# EAGLE schematic untitled (EAGLE 8.7.0)
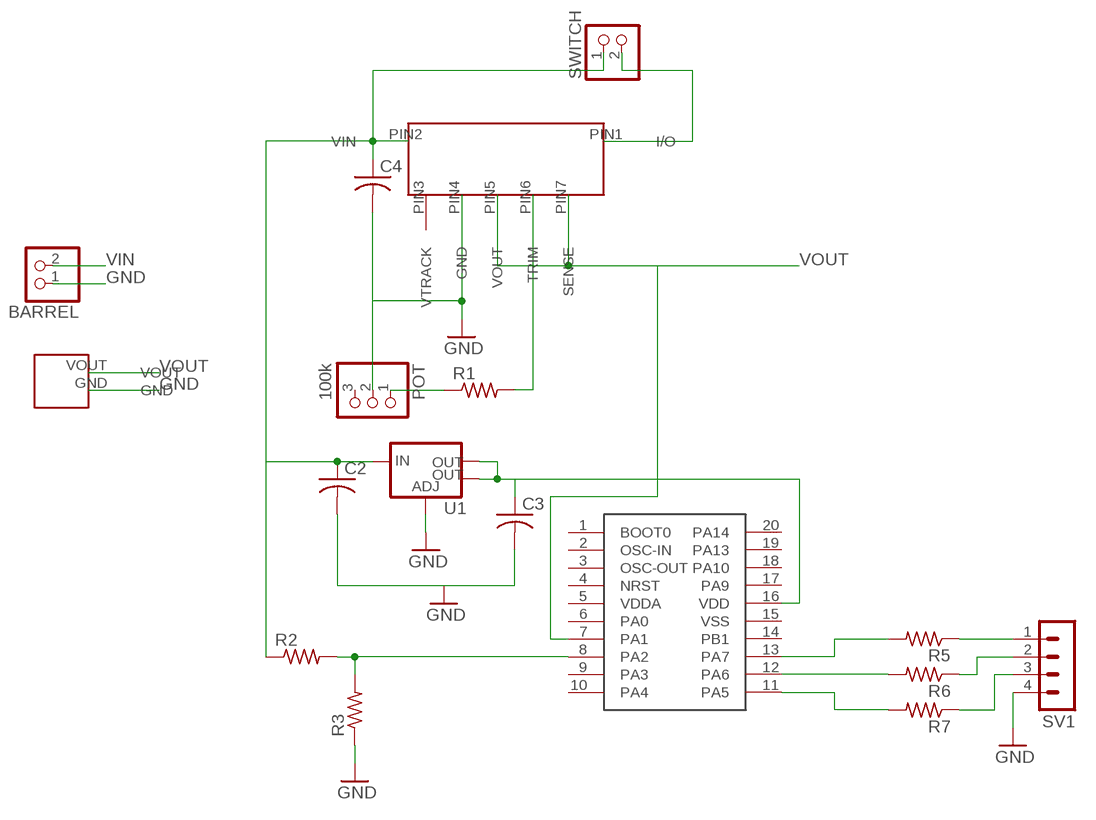
[diagram p0: schematic, sheet 1]

## Parts
BARREL  PINHD-1X2  [1X02]
C2  C-USC1206  [C1206]
C3  C-USC1206  [C1206]
C4  C-USC1206  [C1206]
OKY-T/16-D12N-C  OKY-T/16-D12N-C  [OKY-T/16-D12N-C]
POT  100k  PINHD-1X3  [1X03]
POWER  POWER  [POWER]
R1  R-US_R1206  [R1206]
R2  R-US_R1206  [R1206]
R3  R-US_R1206  [R1206]
R5  R-US_R1206  [R1206]
R6  R-US_R1206  [R1206]
R7  R-US_R1206  [R1206]
SV1  MA04-1  [MA04-1]
SWITCH  PINHD-1X2  [1X02]
U1  V_REG_LM1117SOT223  [SOT223]
U$1  STM32F07  [TSSOP20]

## Nets
GND: BARREL.1 C2.2 C3.2 C4.2 OKY-T/16-D12N-C.PIN4(GND) POT.2 POWER.GND R3.1 SV1.4 U1.1(ADJ)
N$1: OKY-T/16-D12N-C.PIN1(I/O) SWITCH.2
N$2: C3.1 U1.2(OUT) U1.4(OUT) U$1.16(VDD)
N$3: POT.1 R1.1
N$4: OKY-T/16-D12N-C.PIN6(TRIM) R1.2
N$5: R2.2 R3.2 U$1.8(PA2)
N$6: R7.2 U$1.11(PA5)
N$7: R5.2 U$1.13(PA7)
N$8: R6.2 U$1.12(PA6)
N$10: R5.1 SV1.1
N$11: R6.1 SV1.2
N$12: R7.1 SV1.3
VIN: BARREL.2 C2.1 C4.1 OKY-T/16-D12N-C.PIN2(VIN) R2.1 SWITCH.1 U1.3(IN)
VOUT: OKY-T/16-D12N-C.PIN5(VOUT) OKY-T/16-D12N-C.PIN7(SENSE) POWER.VOUT U$1.7(PA1)
Unconnected: OKY-T/16-D12N-C.PIN3(VTRACK) POT.3 U$1.1(BOOT0) U$1.2(OSC-IN) U$1.3(OSC-OUT) U$1.4(NRST) U$1.5(VDDA) U$1.6(PA0) U$1.9(PA3) U$1.10(PA4) U$1.14(PB1) U$1.15(VSS) U$1.17(PA9) U$1.18(PA10) U$1.19(PA13) U$1.20(PA14)

## Library data of the parts
BARREL SWITCH = pinhead:PINHD-1X2: PIN HEADER
C2-C4 = rcl:C-US: CAPACITOR, American symbol; SPICEPREFIX: C
OKY-T/16-D12N-C = chip:OKY-T/16-D12N-C
POT = pinhead:PINHD-1X3: PIN HEADER
POWER = chip:POWER
R1-R3 R5-R7 = rcl:R-US_: RESISTOR, American symbol; SPICEPREFIX: R
SV1 = con-lstb:MA04-1: PIN HEADER; OC_FARNELL: unknown; OC_NEWARK: unknown
U1 = SparkFun-IC-Power:V_REG_LM1117: Voltage Regulator LM1117 Standard adjustable voltage regulator but in SMD form. Spark Fun Electronics SKU : COM-00595; PROD_ID: VREG-08170
U$1 = chip:STM32F07

## Net classes
0 default: width 0.254 mm, drill 0.254 mm, clearance 0.762 mm